# Altium schematic sheet Sensor.SchDoc
size A4
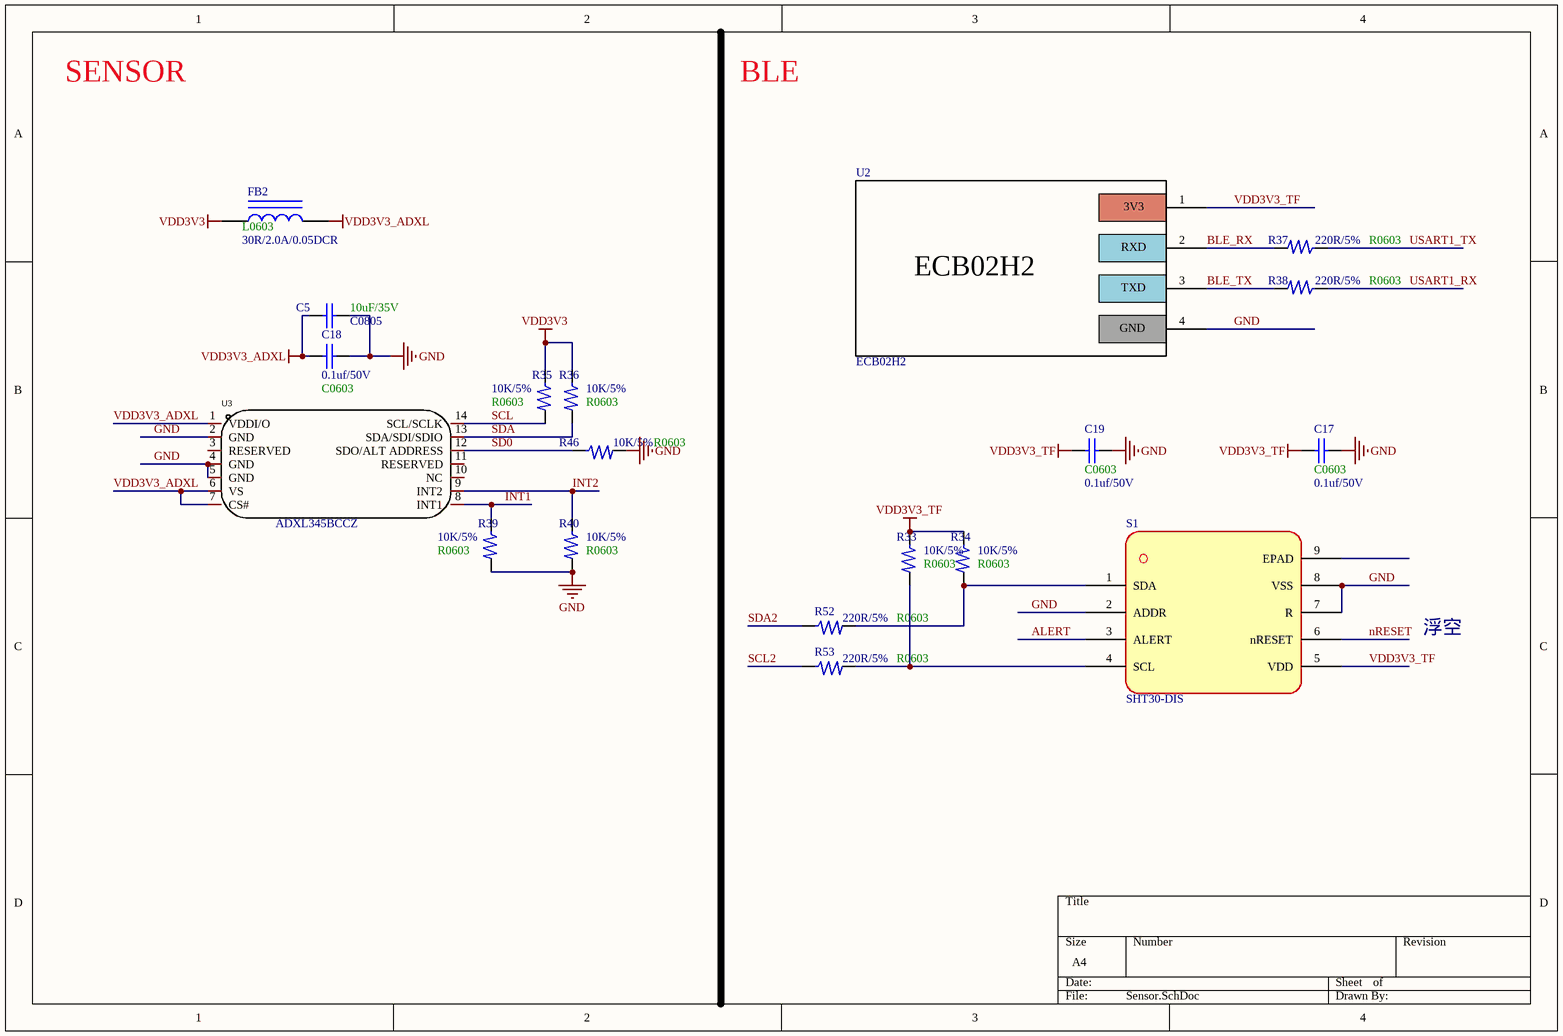
[diagram p0: Sensor.SchDoc]

## Parts
C5  10uF/35V  value C0805  [0805_C]
C17  C0603  value 0.1uf/50V  [0603_C]
C18  0.1uf/50V  Footprint: C0603  [0603_C]
C19  C0603  value 0.1uf/50V  [0603_C]
FB2  30R/2.0A/0.05DCR  Package: L0603  [0603_L]
R33  10K/5%  Footprint: R0603  [0603_R]
R34  10K/5%  Footprint: R0603  [0603_R]
R35  10K/5%  Footprint: R0603  [0603_R]
R36  10K/5%  Footprint: R0603  [0603_R]
R37  220R/5%  Footprint: R0603  [0603_R]
R38  220R/5%  Footprint: R0603  [0603_R]
R39  10K/5%  Footprint: R0603  [0603_R]
R40  10K/5%  Footprint: R0603  [0603_R]
R46  10K/5%  Footprint: R0603  [0603_R]
R52  220R/5%  Footprint: R0603  [0603_R]
R53  220R/5%  Footprint: R0603  [0603_R]
S1  SHT30-DIS  [DFN-8]
U2  ECB02H2  [HDR1X4]
U3  ADXL345BCCZ  [LGA-14_L5.0-W3.0-P0.80-BL]

## Nets
GND: C5.2 C17.1 C18.2 C19.1 R39.1 R40.1 R46.1 S1.2(ADDR) S1.7(R) S1.8(VSS) U2.4 U3.2(GND) U3.4(GND) U3.5(GND)
VDD3V3: FB2.1 R35.2 R36.2
VDD3V3_ADXL: C5.1 C18.1 FB2.2 U3.1(VDDI/O) U3.6(VS) U3.7(CS#)
VDD3V3_TF: C17.2 C19.2 R33.2 R34.2 S1.5(VDD) U2.1
ALERT: S1.3(ALERT)
BLE_RX: R37.1 U2.2
BLE_TX: R38.1 U2.3
INT1: R39.2 U3.8(INT1)
INT2: R40.2 U3.9(INT2)
nRESET: S1.6(nRESET)
SCL: R35.1 U3.14(SCL/SCLK)
SCL2: R53.2
SD0: R46.2 U3.12(SDO/ALT_ADDRESS)
SDA: R36.1 U3.13(SDA/SDI/SDIO)
SDA2: R52.2
USART1_RX: R38.2
USART1_TX: R37.2
NetR33_1: R33.1 R53.1 S1.4(SCL)
NetR34_1: R34.1 R52.1 S1.1(SDA)

Not connected (* = marked no-connect by the designer): S1 9(EPAD); U3 3(RESERVED) 10(NC) 11(RESERVED)

## Notes on the sheet
- SENSOR
- BLE
- 浮空
- (in symbol ECB02H2) 3V3; RXD; TXD; GND

## Library data of the parts
C5 = CAP
C17 C19 = CAP: 0.1uf/50V
C18 = CAP: Capacitor
FB2 = 0603 3.9nH 0.3nH: 贴片电感; ComponentLink1Description: 供应商链接; ComponentLink1URL: http://www.szlcsc.com/product/details_14473.html; Supplier: LC; SuppliersPartNumber: C13818
R33-R40 R46 R52 R53 = 电阻
S1 = SHT30-DIS-B
U3 = ADXL345BCCZ: Manufacturer: ADI(亚德诺)/LINEAR; Add into BOM: yes; Name: ADXL345BCCZ; Symbol: ADXL345BCCZ; Device: ADXL345BCCZ; LCSC Part Name: 加速度计 ADXL345BCCZ; Supplier Part: C579456; Manufacturer Part: ADXL345BCCZ; Supplier Footprint: LGA-14; JLCPCB Part Class: Extended Part; Datasheet: https://atta.szlcsc.com/upload/public/pdf/source/20201030/C579456_55C163C42E67F11674CE9C462EA8849E.pdf; Supplier: LCSC; Convert to PCB: yes